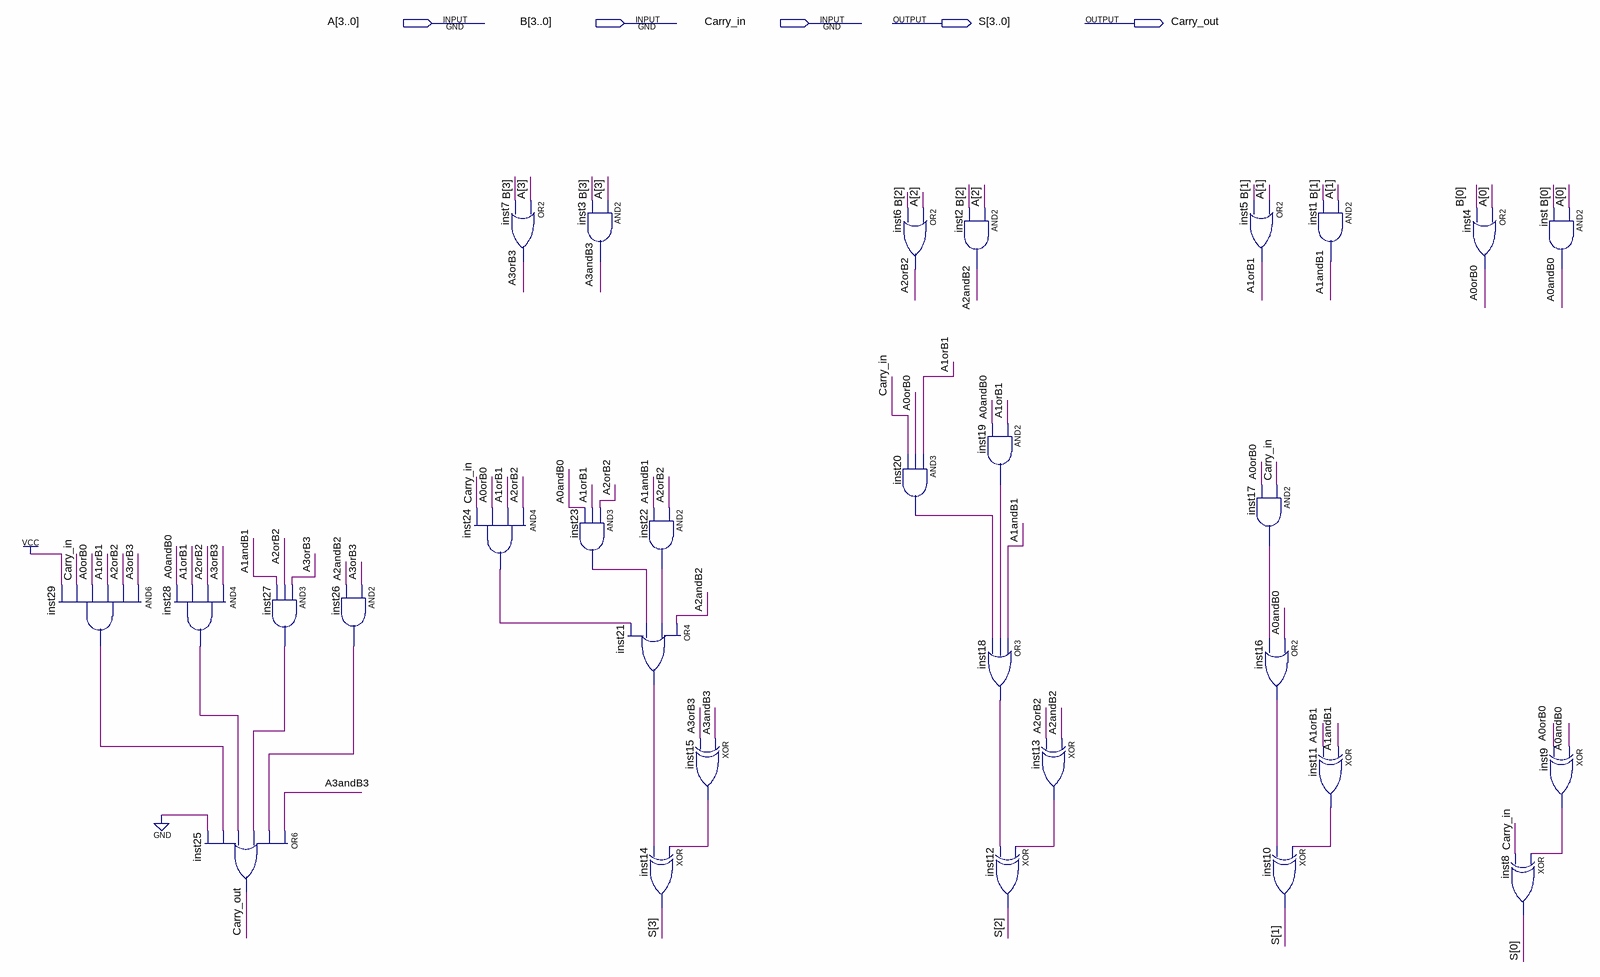
[diagram p0: schematic sheet]
// Quartus schematic BloqueSuma.bdf as structural Verilog: 30 symbols, 5 pins
module BloqueSuma (
  input  [3:0] A,
  input  [3:0] B,
  input  Carry_in,
  output [3:0] S,
  output Carry_out
);

  wire A0andB0, A0orB0, A1andB1, A1orB1, A2andB2, A2orB2, A3andB3, A3orB3, inst9_out, inst11_out, inst13_out,
       inst15_out, inst16_out, inst17_out, inst18_out, inst19_out, inst20_out, inst21_out, inst22_out,
       inst23_out, inst24_out, inst26_out, inst27_out, inst28_out, inst29_out;

  and inst29 (inst29_out, A3orB3, A2orB2, A1orB1, A0orB0, Carry_in, 1'b1);
  and inst28 (inst28_out, A3orB3, A2orB2, A1orB1, A0andB0);
  or inst25 (Carry_out, A3andB3, inst26_out, inst27_out, inst28_out, inst29_out, 1'b0);
  and inst27 (inst27_out, A3orB3, A2orB2, A1andB1);
  and inst26 (inst26_out, A3orB3, A2andB2);
  and inst24 (inst24_out, A2orB2, A1orB1, A0orB0, Carry_in);
  or inst7 (A3orB3, A[3], B[3]);
  and inst3 (A3andB3, A[3], B[3]);
  and inst23 (inst23_out, A2orB2, A1orB1, A0andB0);
  and inst22 (inst22_out, A2orB2, A1andB1);
  or inst21 (inst21_out, A2andB2, inst22_out, inst23_out, inst24_out);
  xor inst14 (S[3], inst15_out, inst21_out);
  xor inst15 (inst15_out, A3andB3, A3orB3);
  or inst6 (A2orB2, A[2], B[2]);
  and inst20 (inst20_out, A1orB1, A0orB0, Carry_in);
  and inst2 (A2andB2, A[2], B[2]);
  and inst19 (inst19_out, A1orB1, A0andB0);
  or inst18 (inst18_out, A1andB1, inst19_out, inst20_out);
  xor inst12 (S[2], inst13_out, inst18_out);
  xor inst13 (inst13_out, A2andB2, A2orB2);
  or inst5 (A1orB1, A[1], B[1]);
  and inst17 (inst17_out, Carry_in, A0orB0);
  or inst16 (inst16_out, A0andB0, inst17_out);
  xor inst10 (S[1], inst11_out, inst16_out);
  and inst1 (A1andB1, A[1], B[1]);
  xor inst11 (inst11_out, A1andB1, A1orB1);
  or inst4 (A0orB0, A[0], B[0]);
  xor inst8 (S[0], inst9_out, Carry_in);
  and inst (A0andB0, A[0], B[0]);
  xor inst9 (inst9_out, A0andB0, A0orB0);
endmodule
